# EAGLE board quantum_AnalougeEngine_V6_1 (EAGLE 9.6.2), part 1 of 2
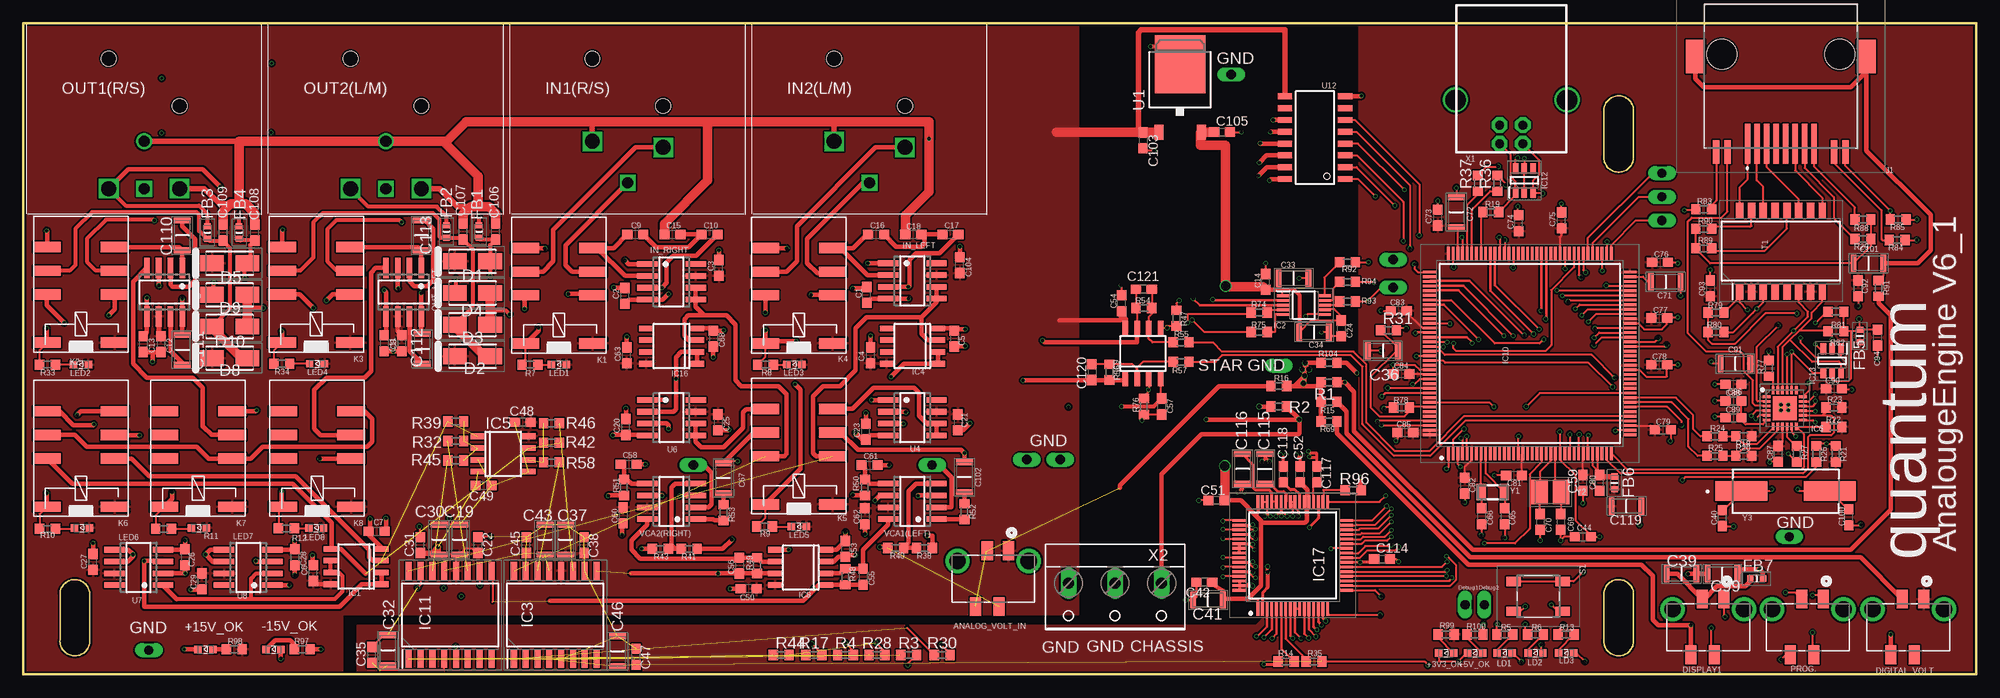
[diagram p12: board, top side]
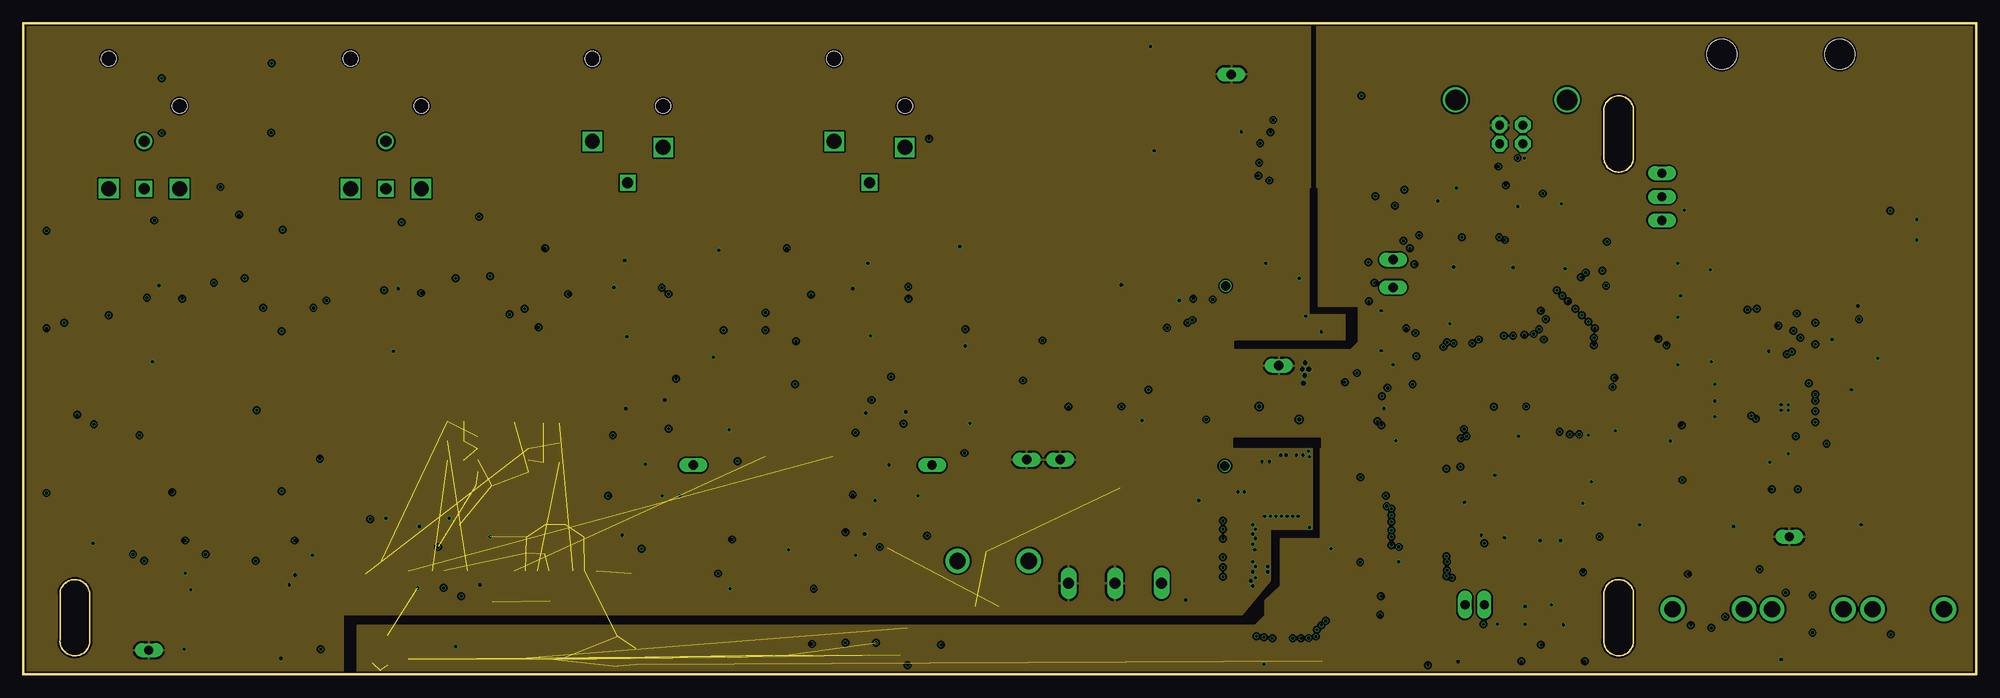
[diagram p13: board, inner layer midTop(AGND)]
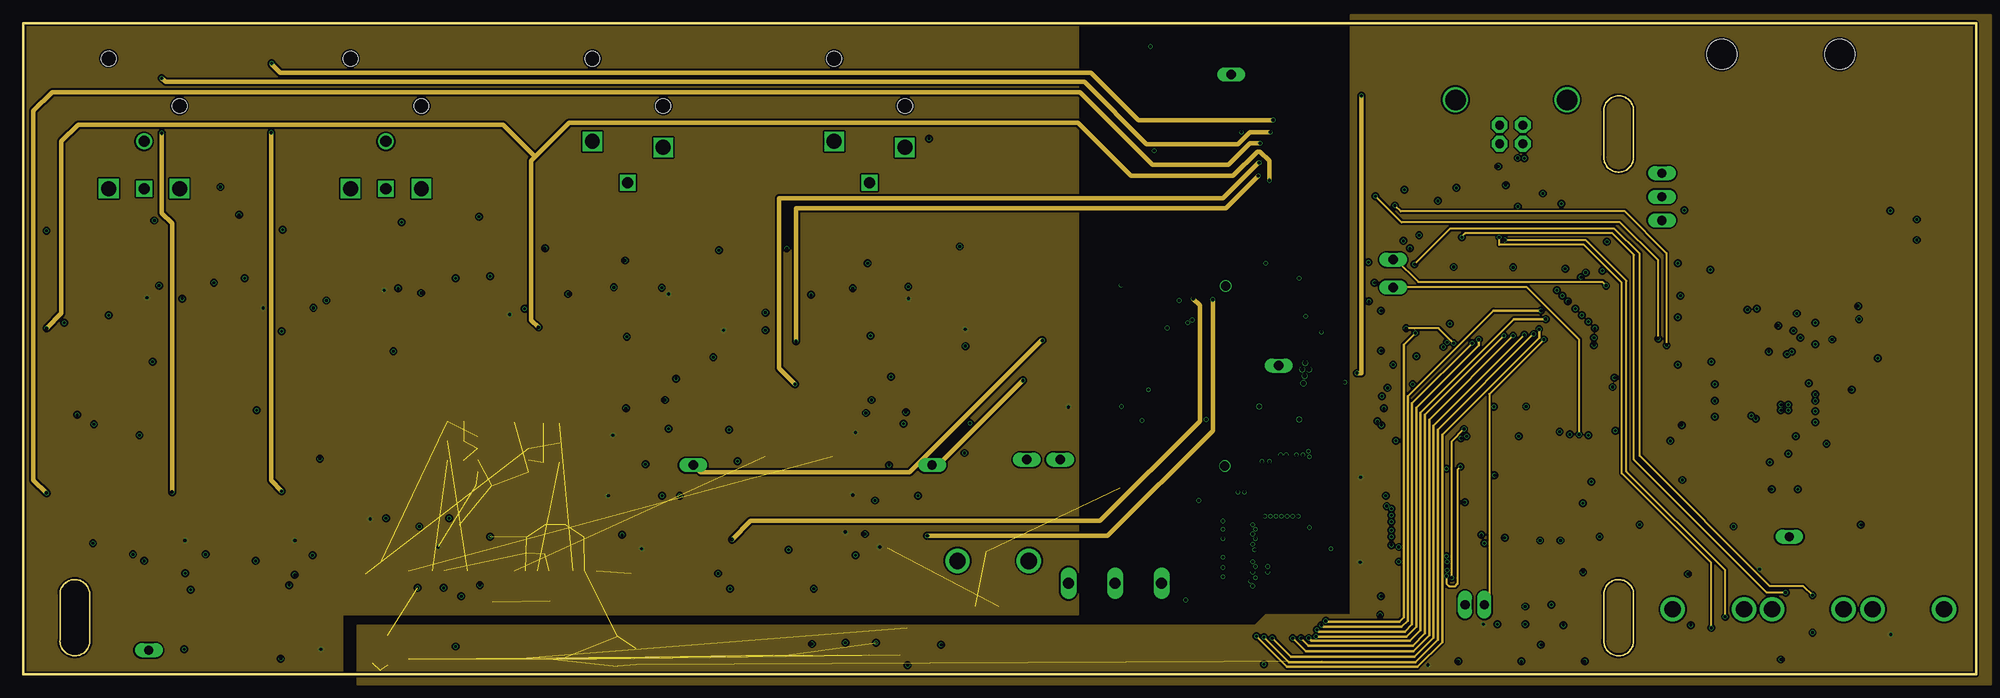
[diagram p14: board, inner layer midBottom(V-/+5V)]
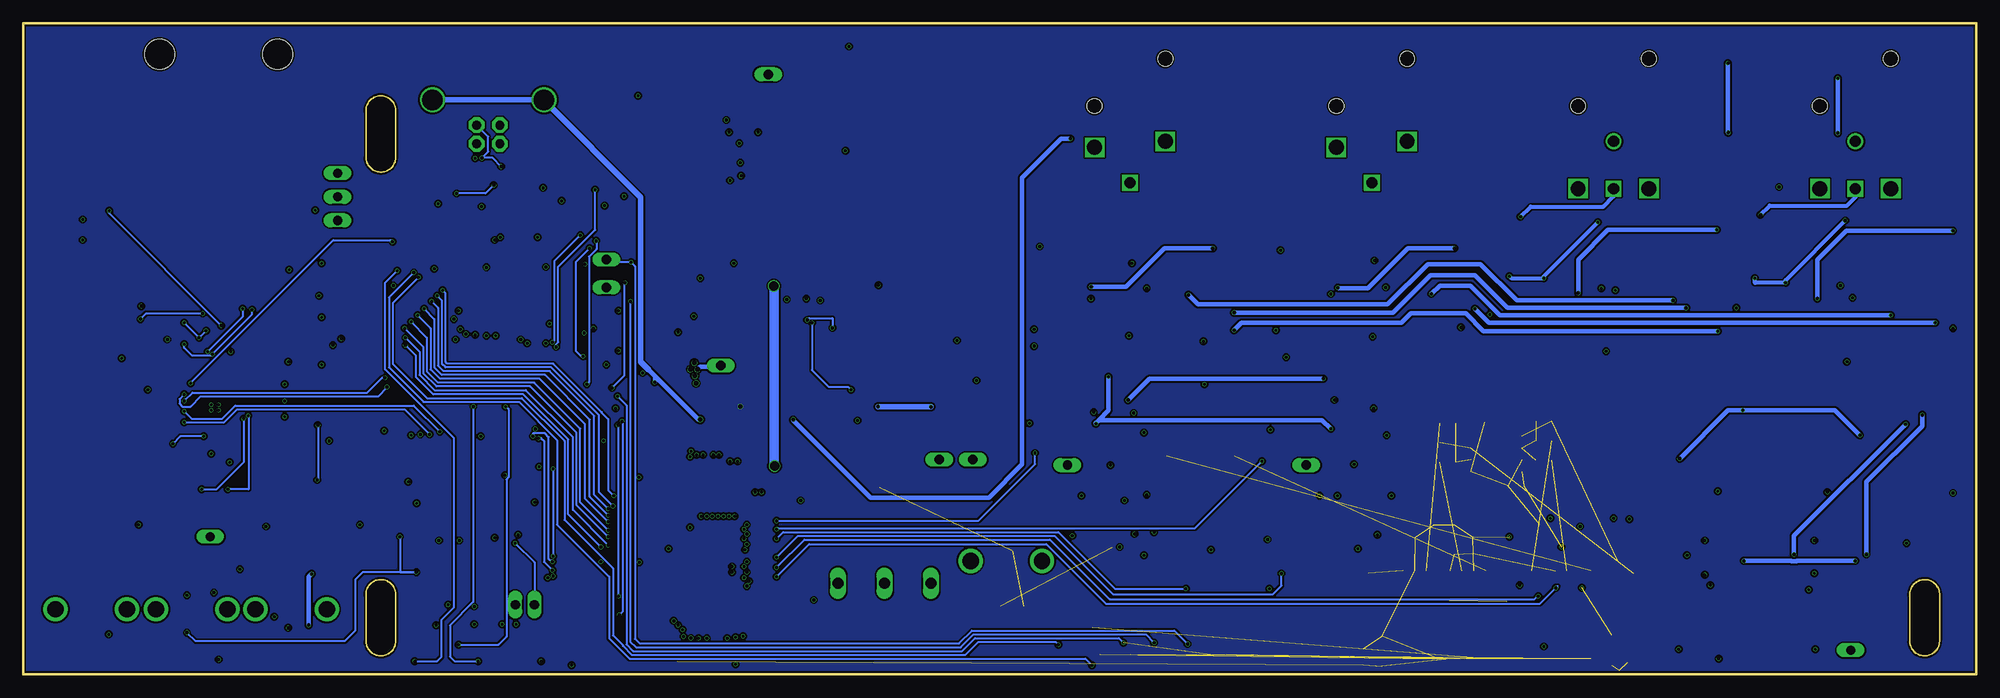
[diagram p15: board, bottom side, seen from below]

Size 210 x 70 mm. Coordinates in mm from the lower left corner, seen from the top.
Outline: 0,0 210,0 210,70 0,70 0,0
Outline: 169.95,60.7 arc-180 173.15,60.5 173.15,55.5 arc-180 169.95,55.7 169.95,60.7
Outline: 169.95,8.7 arc-180 173.15,8.5 173.15,3.5 arc-180 169.95,3.7 169.95,8.7
Outline: 3.95,8.7 arc-180 7.15,8.5 7.15,3.5 arc-180 3.95,3.7 3.95,8.7
Copper layers (1*2+15*16): Top(V+/+3V3) 0.018mm / dielectric 0.362mm / midTop(AGND) 0.035mm / dielectric 0.71mm / midBottom(V-/+5V) 0.035mm / dielectric 0.362mm / Bottom 0.018mm
Design rules "4layer": minimum track width 0.2mm, minimum drill 0.2mm, track to track 0.2mm, track to pad 0.1mm, pad to pad 0.1mm, via to via 0.1mm, smd to smd 0.1mm, copper to edge 0.2mm, drill to drill 0.21mm, minimum pad ring 0.25mm, minimum via ring 0.05mm, stop-mask expansion 0.01mm, vias tented up to drill 0mil, thermal gap 10mil

## Footprints (pad centres in the part's own frame; a part is rotated, then mirrored left to right if it is on the bottom)
WL-SMCW_0603 = smd 0.8 x 0.8: 1 -0.8,0; 2 0.8,0
MOLEX_90814-0204 = smd 1.194 x 2.007: 1 0.254,0; 2 1.27,5.994; 3 2.54,0; 4 3.81,5.994 | drill 1.753 pad 2.629: 5 -1.93,1.092; 6 5.74,1.092
C0603 = smd 1.1 x 1: 1 -0.85,0; 2 0.85,0
C1206 = smd 0.62 x 1.82: 1 -1.6,0; 2 1.6,0
DIONM5025X231N = smd 2.55 x 1.7: 1 -1.9,0; 2 1.9,0
THT_PIN = drill 1 long: P$1 0,0
BLM18KG102SH1J = smd 0.65 x 0.7: 1 -0.675,0; 2 0.675,0
SOIC8 = smd 0.6 x 1.5: 1 -1.905,-2.75; 2 -0.635,-2.75; 3 0.635,-2.75; 4 1.905,-2.75; 5 1.905,2.75; 6 0.635,2.75; 7 -0.635,2.75; 8 -1.905,2.75
SOP50P490X110-10N = smd 1.4 x 0.3: 1 -2.2,1; 2 -2.2,0.5; 3 -2.2,0; 4 -2.2,-0.5; 5 -2.2,-1; 6 2.2,-1; 7 2.2,-0.5; 8 2.2,0; 9 2.2,0.5; 10 2.2,1
SOIC127P1030X265-16N = smd 1.95 x 0.65: 1 -4.725,4.445; 2 -4.725,3.175; 3 -4.725,1.905; 4 -4.725,0.635; 5 -4.725,-0.635; 6 -4.725,-1.905; 7 -4.725,-3.175; 8 -4.725,-4.445; 9 4.725,-4.445; 10 4.725,-3.175; 11 4.725,-1.905; 12 4.725,-0.635; 13 4.725,0.635; 14 4.725,1.905; 15 4.725,3.175; 16 4.725,4.445
QFN50P400X400X100-25N = smd 0.85 x 0.3: 1 -1.95,1.25; 2 -1.95,0.75; 3 -1.95,0.25; 4 -1.95,-0.25; 5 -1.95,-0.75; 6 -1.95,-1.25; 13 1.95,-1.25; 14 1.95,-0.75; 15 1.95,-0.25; 16 1.95,0.25; 17 1.95,0.75; 18 1.95,1.25 | smd 0.3 x 0.85: 7 -1.25,-1.95; 8 -0.75,-1.95; 9 -0.25,-1.95; 10 0.25,-1.95; 11 0.75,-1.95; 12 1.25,-1.95; 19 1.25,1.95; 20 0.75,1.95; 21 0.25,1.95; 22 -0.25,1.95; 23 -0.75,1.95; 24 -1.25,1.95 | smd 2.6 x 2.6: 25 0,0
QFP50P2200X2200X160-144N = smd 1.475 x 0.3: 1 -10.738,8.75; 2 -10.738,8.25; 3 -10.738,7.75; 4 -10.738,7.25; 5 -10.738,6.75; 6 -10.738,6.25; 7 -10.738,5.75; 8 -10.738,5.25; 9 -10.738,4.75; 10 -10.738,4.25; 11 -10.738,3.75; 12 -10.738,3.25; 13 -10.738,2.75; 14 -10.738,2.25; 15 -10.738,1.75; 16 -10.738,1.25; 17 -10.738,0.75; 18 -10.738,0.25; 19 -10.738,-0.25; 20 -10.738,-0.75; 21 -10.738,-1.25; 22 -10.738,-1.75; 23 -10.738,-2.25; 24 -10.738,-2.75; 25 -10.738,-3.25; 26 -10.738,-3.75; 27 -10.738,-4.25; 28 -10.738,-4.75; 29 -10.738,-5.25; 30 -10.738,-5.75; 31 -10.738,-6.25; 32 -10.738,-6.75; 33 -10.738,-7.25; 34 -10.738,-7.75; 35 -10.738,-8.25; 36 -10.738,-8.75; 73 10.738,-8.75; 74 10.738,-8.25; 75 10.738,-7.75; 76 10.738,-7.25; 77 10.738,-6.75; 78 10.738,-6.25; 79 10.738,-5.75; 80 10.738,-5.25; 81 10.738,-4.75; 82 10.738,-4.25; 83 10.738,-3.75; 84 10.738,-3.25; 85 10.738,-2.75; 86 10.738,-2.25; 87 10.738,-1.75; 88 10.738,-1.25; 89 10.738,-0.75; 90 10.738,-0.25; 91 10.738,0.25; 92 10.738,0.75; 93 10.738,1.25; 94 10.738,1.75; 95 10.738,2.25; 96 10.738,2.75; 97 10.738,3.25; 98 10.738,3.75; 99 10.738,4.25; 100 10.738,4.75; 101 10.738,5.25; 102 10.738,5.75; 103 10.738,6.25; 104 10.738,6.75; 105 10.738,7.25; 106 10.738,7.75; 107 10.738,8.25; 108 10.738,8.75 | smd 0.3 x 1.475: 37 -8.75,-10.738; 38 -8.25,-10.738; 39 -7.75,-10.738; 40 -7.25,-10.738; 41 -6.75,-10.738; 42 -6.25,-10.738; 43 -5.75,-10.738; 44 -5.25,-10.738; 45 -4.75,-10.738; 46 -4.25,-10.738; 47 -3.75,-10.738; 48 -3.25,-10.738; 49 -2.75,-10.738; 50 -2.25,-10.738; 51 -1.75,-10.738; 52 -1.25,-10.738; 53 -0.75,-10.738; 54 -0.25,-10.738; 55 0.25,-10.738; 56 0.75,-10.738; 57 1.25,-10.738; 58 1.75,-10.738; 59 2.25,-10.738; 60 2.75,-10.738; 61 3.25,-10.738; 62 3.75,-10.738; 63 4.25,-10.738; 64 4.75,-10.738; 65 5.25,-10.738; 66 5.75,-10.738; 67 6.25,-10.738; 68 6.75,-10.738; 69 7.25,-10.738; 70 7.75,-10.738; 71 8.25,-10.738; 72 8.75,-10.738; 109 8.75,10.738; 110 8.25,10.738; 111 7.75,10.738; 112 7.25,10.738; 113 6.75,10.738; 114 6.25,10.738; 115 5.75,10.738; 116 5.25,10.738; 117 4.75,10.738; 118 4.25,10.738; 119 3.75,10.738; 120 3.25,10.738; 121 2.75,10.738; 122 2.25,10.738; 123 1.75,10.738; 124 1.25,10.738; 125 0.75,10.738; 126 0.25,10.738; 127 -0.25,10.738; 128 -0.75,10.738; 129 -1.25,10.738; 130 -1.75,10.738; 131 -2.25,10.738; 132 -2.75,10.738; 133 -3.25,10.738; 134 -3.75,10.738; 135 -4.25,10.738; 136 -4.75,10.738; 137 -5.25,10.738; 138 -5.75,10.738; 139 -6.25,10.738; 140 -6.75,10.738; 141 -7.25,10.738; 142 -7.75,10.738; 143 -8.25,10.738; 144 -8.75,10.738
SOT95P280X145-6N = smd 1.15 x 0.6: 1 -1.3,0.95; 2 -1.3,0; 3 -1.3,-0.95; 4 1.3,-0.95; 5 1.3,0; 6 1.3,0.95
QFP50P1200X1200X160-64N = smd 1.475 x 0.3: 1 -5.738,3.75; 2 -5.738,3.25; 3 -5.738,2.75; 4 -5.738,2.25; 5 -5.738,1.75; 6 -5.738,1.25; 7 -5.738,0.75; 8 -5.738,0.25; 9 -5.738,-0.25; 10 -5.738,-0.75; 11 -5.738,-1.25; 12 -5.738,-1.75; 13 -5.738,-2.25; 14 -5.738,-2.75; 15 -5.738,-3.25; 16 -5.738,-3.75; 33 5.738,-3.75; 34 5.738,-3.25; 35 5.738,-2.75; 36 5.738,-2.25; 37 5.738,-1.75; 38 5.738,-1.25; 39 5.738,-0.75; 40 5.738,-0.25; 41 5.738,0.25; 42 5.738,0.75; 43 5.738,1.25; 44 5.738,1.75; 45 5.738,2.25; 46 5.738,2.75; 47 5.738,3.25; 48 5.738,3.75 | smd 0.3 x 1.475: 17 -3.75,-5.738; 18 -3.25,-5.738; 19 -2.75,-5.738; 20 -2.25,-5.738; 21 -1.75,-5.738; 22 -1.25,-5.738; 23 -0.75,-5.738; 24 -0.25,-5.738; 25 0.25,-5.738; 26 0.75,-5.738; 27 1.25,-5.738; 28 1.75,-5.738; 29 2.25,-5.738; 30 2.75,-5.738; 31 3.25,-5.738; 32 3.75,-5.738; 49 3.75,5.738; 50 3.25,5.738; 51 2.75,5.738; 52 2.25,5.738; 53 1.75,5.738; 54 1.25,5.738; 55 0.75,5.738; 56 0.25,5.738; 57 -0.25,5.738; 58 -0.75,5.738; 59 -1.25,5.738; 60 -1.75,5.738; 61 -2.25,5.738; 62 -2.75,5.738; 63 -3.25,5.738; 64 -3.75,5.738
NEUTRIK_NC3FAH = drill 1.6 square: 1 -3.81,-12.7; 2 3.81,-13.335 | drill 1.2 square: 3 0,-17.15 | hole 1.6: -3.81,-3.81; 3.81,-8.89
SO08 = smd 0.6 x 2.2: 1 -1.905,-2.6; 2 -0.635,-2.6; 3 0.635,-2.6; 4 1.905,-2.6; 5 1.905,2.6; 6 0.635,2.6; 7 -0.635,2.6; 8 -1.905,2.6
GWLEXSMTS988GY = smd 0.61 x 4.3: 1 3.57,7.05; 2 2.55,7.05; 3 1.53,7.05; 4 0.51,7.05; 5 -0.51,7.05; 6 -1.53,7.05; 7 -2.55,7.05; 8 -3.57,7.05 | smd 0.7 x 2.5: 9 6.95,7.95; 10 5.74,7.95; 11 -5.74,7.95; 12 -6.95,7.95 | smd 2.032 x 3.6: MP1 -9.204,-2.3; MP2 9.204,-2.3 | hole 3.25: -6.35,-2.55; 6.35,-2.55
351 = smd 1.11 x 3: 1 -2.623,-3.645; 2 -2.623,3.645; P1 5.096,-3.645; P2 5.096,3.645; Q1 2.556,-3.645; Q2 2.556,3.645; S1 7.636,-3.645; S2 7.636,3.645
NEUTRIK_NC3MAH = drill 1.6 square: 1 3.81,-17.78; 2 -3.81,-17.78 | drill 1.2 square: 3 0,-17.78 | drill 1.2: G 0,-12.7 | hole 1.6: -3.81,-3.8; 3.81,-8.89
R0603 = smd 1 x 1.1: 1 -0.85,0; 2 0.85,0
PTS647SN50SMTR2LFS = smd 1.55 x 1: 1 -2.625,-1.6; 2 2.625,-1.6; 3 2.625,1.6; 4 -2.625,1.6
SOIC127P940X597-16N = smd 1.645 x 0.8: 1 -4.378,4.445; 2 -4.378,3.175; 3 -4.378,1.905; 4 -4.378,0.635; 5 -4.378,-0.635; 6 -4.378,-1.905; 7 -4.378,-3.175; 8 -4.378,-4.445; 9 4.378,-4.445; 10 4.378,-3.175; 11 4.378,-1.905; 12 4.378,-0.635; 13 4.378,0.635; 14 4.378,1.905; 15 4.378,3.175; 16 4.378,4.445
TO252 = smd 1 x 1.6: 1 -2.28,-4.8; 3 2.28,-4.8 | smd 5.4 x 6.2: 2 0,2.5
SOIC16 = smd 1.524 x 0.635: 1 -3.24,4.445; 2 -3.24,3.175; 3 -3.24,1.905; 4 -3.24,0.635; 5 -3.24,-0.635; 6 -3.24,-1.905; 7 -3.24,-3.175; 8 -3.24,-4.445; 9 3.24,-4.445; 10 3.24,-3.175; 11 3.24,-1.905; 12 3.24,-0.635; 13 3.24,0.635; 14 3.24,1.905; 15 3.24,3.175; 16 3.24,4.445
SMARTPRJ_PN61729 = drill 0.95 pad 1.676 octagon: 1 1.25,4.71; 2 -1.25,4.71; 3 -1.25,2.71; 4 1.25,2.71 | drill 2.2: P$1 -6,0; P$2 6,0
W237-103 = drill 1.194 long: 1 -5,-1.29; 2 0,-1.29; 3 5,-1.29
NX3215SA = smd 1 x 1.8: 1 -1.25,0; 2 1.25,0
RESC3226X100N = smd 1.75 x 2.65: 1 -1.15,0; 2 1.15,0
ABLS = smd 5.6 x 2.1: 1 -4.75,0; 2 4.75,0

## Placement (x,y rotation side)
+3V3_OK  LED_GREEN_SMD  [WL-SMCW_0603]  153,2.3 0 top
+5V_OK  LED_GREEN_SMD  [WL-SMCW_0603]  156.1,2.3 0 top
+15V_OK  LED_GREEN_SMD  [WL-SMCW_0603]  19.6,2.7 0 top
-15V_OK  LED_GREEN_SMD  [WL-SMCW_0603]  26.9,2.7 0 top
ANALOG_VOLT_IN  90814-0204  [MOLEX_90814-0204]  106.2,13.3 180 top
C1  100 nF  [C0603]  90.7,40.8 90 top
C2  100 nF  [C0603]  64.7,40.7 90 top
C3  100 nF  [C0603]  74.8,43.7 90 top
C4  100 nF  [C0603]  91.1,34.3 90 top
C5  100 nF  [C0603]  100.1,36.1 270 top
C6  100 nF  [C0603]  31.2,10.9 90 top
C7  100 nF  [C0603]  38,15.4 0 top
C8  100 nF  [C0603]  40.7,35.6 270 top
C9  470 pF  [C0603]  65.8,47.3 0 top
C10  470 pF  [C0603]  73.8,47.3 0 top
C11  100 nF  [C0603]  38.8,35.6 270 top
C12  100 nF  [C0603]  14.8,35.5 270 top
C13  100 nF  [C0603]  12.9,35.5 270 top
C14  100 nF  [C0603]  133.6,42.2 90 top
C15  47 pF  [C0603]  69.8,47.3 0 top
C16  470 pF  [C0603]  91.7,47.3 0 top
C17  470 pF  [C0603]  99.7,47.3 0 top
C18  47 pF  [C0603]  95.7,47.3 0 top
C19  10 uF  [C1206]  46.9,14.5 90 top
C20  100 nF  [C0603]  64.8,26.6 90 top
C21  100 nF  [C0603]  100.5,27.1 270 top
C22  100 nF  [C0603]  48.9,13.9 90 top
C23  100 nF  [C0603]  90.6,26.1 90 top
C24  100 nF  [C0603]  141.7,37.2 270 top
C25  100 nF  [C0603]  74.7,27.1 270 top
C26  100 nF  [C0603]  17.4,12.6 270 top
C27  100 nF  [C0603]  7.5,12.1 90 top
C28  100 nF  [C0603]  29.2,12.6 270 top
C29  100 nF  [C0603]  19.2,10 270 top
C30  10 uF  [C1206]  44.7,14.5 90 top
C31  100 nF  [C0603]  42.7,13.9 90 top
C32  10 uF  [C1206]  39.2,2.6 90 top
C33  10 uF  [C1206]  136.6,42.6 0 top
C34  10 uF  [C1206]  138.8,36.8 0 top
C35  100 nF  [C0603]  37.5,2.1 90 top
C36  2.2 uF  [C1206]  146.2,34.8 0 top
C37  10 uF  [C1206]  58.3,14.5 90 top
C38  100 nF  [C0603]  60.3,13.9 90 top
C39  10 uF  [C1206]  178.3,10.8 0 top
C40  30 pF  [C0603]  182.7,16.8 90 top
C41  10 uF  [C1206]  127.4,8 180 top
C42  100 nF  [C0603]  127,9.9 180 top
C43  10 uF  [C1206]  56.1,14.5 90 top
C44  100 nF  [C0603]  167.7,14.8 0 top
C45  100 nF  [C0603]  54.1,13.9 90 top
C46  10 uF  [C1206]  63.9,2.5 90 top
C47  100 nF  [C0603]  65.9,1.9 90 top
C48  100 nF  [C0603]  53.7,27.1 180 top
C49  100 nF  [C0603]  49.5,20.3 0 top
C50  100 nF  [C0603]  78,9.2 180 top
C51  100 nF  [C0603]  128.3,18.7 180 top
C52  100 nF  [C0603]  137.3,21.5 90 top
C53  100 nF  [C0603]  88.4,13.5 270 top
C54  100 nF  [C0603]  118.1,39.9 90 top
C55  22 pF  [C0603]  90.3,10.5 270 top
C56  22 pF  [C0603]  77,11.7 270 top
C57  100 nF  [C0603]  122.4,28.8 270 top
C58  100 nF  [C0603]  65.1,22.6 0 top
C59  100 nF  [C0603]  167.7,20.6 90 top
C60  100 nF  [C0603]  64.5,17.1 270 top
C61  100 nF  [C0603]  91,22.5 0 top
C62  100 nF  [C0603]  90.5,17 270 top
C63  100 nF  [C0603]  64.9,34.3 90 top
C65  2.7 pF  [C0603]  159.3,17 270 top
C66  2.7 pF  [C0603]  156.8,17 270 top
C67  10 uF  [C1206]  75.3,21.1 270 top
C68  100 nF  [C0603]  74.2,36.1 270 top
C69  4.3 pF  [C0603]  165.3,16.4 270 top
C70  4.3 pF  [C0603]  163.1,16.4 270 top
C71  2.2 uF  [C1206]  176.6,42.2 0 top
C72  2.2 uF  [C1206]  154.1,49.7 90 top
C73  100 nF  [C0603]  152.1,49.1 90 top
C74  100 nF  [C0603]  160.8,48.5 90 top
C75  100 nF  [C0603]  165.4,48.8 90 top
C76  100 nF  [C0603]  176,44.3 0 top
C77  100 nF  [C0603]  175.9,38.3 0 top
C78  100 nF  [C0603]  175.9,33.3 0 top
C79  100 nF  [C0603]  176.3,26.3 0 top
C80  100 nF  [C0603]  169.5,20.6 90 top
C81  100 nF  [C0603]  160.3,21.4 0 top
C82  100 nF  [C0603]  155,20.3 90 top
C83  100 nF  [C0603]  147.9,39.1 180 top
C84  100 nF  [C0603]  148.2,32.3 180 top
C85  100 nF  [C0603]  148.6,26 180 top
C86  100 nF  [C0603]  183.9,31.2 0 top
C87  100 nF  [C0603]  188.7,23.7 90 top
C88  1 uF  [C0603]  183.9,29.4 0 top
C89  470 pF  [C0603]  183.9,27.6 0 top
C90  100 nF  [C0603]  194.7,30.7 180 top
C91  10 uF  [C1206]  184.1,33.4 180 top
C92  100 nF  [C0603]  197.3,41.5 90 top
C93  100 nF  [C0603]  181.4,41.5 270 top
C94  100 nF  [C0603]  199.4,36.2 90 top
C99  10 uF  [C1206]  182.7,10.8 180 top
C100  30 pF  [C0603]  196.3,16.9 90 top
C101  4.7 uF  [C1206]  198.4,44.2 0 top
C102  10 uF  [C1206]  101.2,21.2 270 top
C103  330 nF  [C0603]  120.4,57.4 270 top
C104  100 nF  [C0603]  100.7,44 90 top
C105  100 nF  [C0603]  128.9,58.3 0 top
C106  100 nF  [C0603]  50.8,47.6 90 top
C107  100 nF  [C0603]  47.3,47.6 90 top
C108  100 nF  [C0603]  24.9,47.5 90 top
C109  100 nF  [C0603]  21.5,47.5 90 top
C110  10 uF  [C1206]  17.1,47.2 270 top
C111  10 uF  [C1206]  17.1,34.9 90 top
C112  10 uF  [C1206]  42.9,35 90 top
C113  10 uF  [C1206]  42.8,47.2 270 top
C114  100 nF  [C0603]  146.1,12.4 0 top
C115  10 uF  [C1206]  133.5,22.1 90 top
C116  10 uF  [C1206]  131.1,22.1 270 top
C117  1 uF  [C0603]  139.1,21.5 90 top
C118  1 uF  [C0603]  135.5,21.5 90 top
C119  4.7 uF  [C1206]  172.4,18.1 180 top
C120  22 pF  [C0603]  114.9,32.5 270 top
C121  22 pF  [C0603]  120.5,41.4 180 top
D1  FM4004-W  [DIONM5025X231N]  48.3,44.4 0 top
D2  FM4004-W  [DIONM5025X231N]  48.3,34.2 0 top
D3  FM4004-W  [DIONM5025X231N]  48.3,37.6 0 top
D4  FM4004-W  [DIONM5025X231N]  48.3,41 0 top
D5  FM4004-W  [DIONM5025X231N]  22.2,44.2 0 top
D8  FM4004-W  [DIONM5025X231N]  22.2,34 0 top
D9  FM4004-W  [DIONM5025X231N]  22.2,40.8 0 top
D10  FM4004-W  [DIONM5025X231N]  22.2,37.4 0 top
DEBUG1  TPTHT  [THT_PIN]  155.04,7.5 90 top
DEBUG2  TPTHT  [THT_PIN]  157.1,7.5 90 top
DIGITAL_VOLT  90814-0204  [MOLEX_90814-0204]  204.6,8.1 180 top
DISPLAY1  90814-0204  [MOLEX_90814-0204]  183.1,8.1 180 top
FB1  FERITTE-BREAD  [BLM18KG102SH1J]  49,47.6 90 top
FB2  FERITTE-BREAD  [BLM18KG102SH1J]  45.5,47.6 90 top
FB3  FERITTE-BREAD  [BLM18KG102SH1J]  19.8,47.5 90 top
FB4  FERITTE-BREAD  [BLM18KG102SH1J]  23.2,47.5 90 top
FB5  0 R  [BLM18KG102SH1J]  197.5,36.4 90 top
FB6  FERITTE-BREAD  [BLM18KG102SH1J]  171.1,20.6 90 top
FB7  FERITTE-BREAD  [BLM18KG102SH1J]  186.4,10.3 0 top
GND  TPTHT  [THT_PIN]  189.9,14.8 0 top
IC1  OP275  [SOIC8]  35.8,11.6 90 top
IC2  DAC084S085CIMM_NOPB  [SOP50P490X110-10N]  137.7,39.7 0 top
IC3  PGA2320IDW  [SOIC127P1030X265-16N]  57.2,6.4 90 top
IC4  OP275  [SOIC8]  95.6,35.3 90 top
IC5  OP275  [SOIC8]  51.6,23.7 270 top
IC6  LAN8742A-CZ-TR  [QFN50P400X400X100-25N]  189.4,28.6 0 top
IC8  OP275  [SOIC8]  83.6,11.5 90 top
IC9  NE5532  [SOIC8]  120.4,34.5 0 top
IC10  STM32F767ZIT6  [QFP50P2200X2200X160-144N]  162,34.5 90 top
IC11  PGA2320IDW  [SOIC127P1030X265-16N]  45.9,6.4 90 top
IC12  ESDA6V1BC6  [SOT95P280X145-6N]  161.4,53.1 90 top
IC13  USBLC6-4SC6  [SOT95P280X145-6N]  194.5,33.7 270 top
IC16  OP275  [SOIC8]  69.7,35.3 90 top
IC17  AD7606BSTZ-6  [QFP50P1200X1200X160-64N]  136.5,12.8 90 top
IN1(R/S)  NEUTRIK_NC3FAH  [NEUTRIK_NC3FAH]  65,70 0 top
IN2(L/M)  NEUTRIK_NC3FAH  [NEUTRIK_NC3FAH]  91,70 0 top
IN_LEFT  THAT1240  [SO08]  95.6,42.3 270 top
IN_RIGHT  THAT1240  [SO08]  69.7,42.2 270 top
J1  GWLEX-SMT-S988G_Y  [GWLEXSMTS988GY]  188.99,64.11 180 top
K1  Relay  [351]  57.6,38.2 90 top
K2  Relay  [351]  6.2,38.3 90 top
K3  Relay  [351]  31.5,38.3 90 top
K4  Relay  [351]  83.4,38.2 90 top
K5  Relay  [351]  83.4,20.9 90 top
K6  Relay  [351]  6.2,20.65 90 top
K7  Relay  [351]  18.8,20.65 90 top
K8  Relay  [351]  31.6,20.65 90 top
LD1  LED_YELOW_SMD  [WL-SMCW_0603]  159.3,2.3 0 top
LD2  LED_RED_SMD  [WL-SMCW_0603]  162.6,2.3 0 top
LD3  LED_GREEN_SMD  [WL-SMCW_0603]  165.9,2.3 0 top
LED1  LED_BLUE_SMD  [WL-SMCW_0603]  57.6,33.3 0 top
LED2  LED_BLUE_SMD  [WL-SMCW_0603]  6.2,33.3 0 top
LED3  LED_BLUE_SMD  [WL-SMCW_0603]  82.9,33.3 0 top
LED4  LED_BLUE_SMD  [WL-SMCW_0603]  31.6,33.4 0 top
LED5  LED_BLUE_SMD  [WL-SMCW_0603]  83.4,15.9 0 top
LED6  LED_BLUE_SMD  [WL-SMCW_0603]  6.3,15.75 0 top
LED7  LED_BLUE_SMD  [WL-SMCW_0603]  18.9,15.75 0 top
LED8  LED_BLUE_SMD  [WL-SMCW_0603]  31.5,15.75 0 top
OUT1(R/S)  NEUTRIK_NC3MAH  [NEUTRIK_NC3MAH]  13,70 0 top
OUT2(L/M)  NEUTRIK_NC3MAH  [NEUTRIK_NC3MAH]  39,70 0 top
OUT_LEFT  THAT1646  [SO08]  40.9,41.1 180 top
OUT_RIGHT  THAT1646  [SO08]  15.2,41.1 180 top
PROG.  90814-0204  [MOLEX_90814-0204]  193.8,8.1 180 top
R1  0 R  [R0603]  140.4,31.4 180 top
R2  0 R  [R0603]  135,28.8 180 top
R3  500 R  [R0603]  95.2,2.1 0 top
R4  500 R  [R0603]  88.4,2.1 0 top
R5  680 R  [R0603]  159.3,4.3 0 top
R6  680 R  [R0603]  162.6,4.3 0 top
R7  680 R  [R0603]  54.5,33.3 0 top
R8  680 R  [R0603]  79.8,33.3 0 top
R9  680 R  [R0603]  79.7,15.9 0 top
R10  680 R  [R0603]  2.6,15.65 0 top
R11  680 R  [R0603]  15.1,15.65 0 top
R12  680 R  [R0603]  28.3,15.7 0 top
R13  680 R  [R0603]  165.9,4.3 0 top
R14  10 k  [R0603]  135.8,1.4 180 top
R15  0 R  [R0603]  140.4,29.3 180 top
R16  0 R  [R0603]  135,31 0 top
R17  500 R  [R0603]  85,2.1 0 top
R18  10 k  [R0603]  185,25.6 180 top
R19  10 k  [R0603]  157.8,49.7 0 top
R20  10 k  [R0603]  185,23.5 180 top
R21  10 k  [R0603]  194.9,23.7 90 top
R22  1k5  [R0603]  194.7,26.6 180 top
R23  10 k  [R0603]  194.7,28.7 0 top
R24  33 R  [R0603]  181.9,25.6 0 top
R25  33 R  [R0603]  181.9,23.5 0 top
R26  33 R  [R0603]  192.8,23.7 90 top
R27  10 k  [R0603]  190.7,23.7 90 top
R28  500 R  [R0603]  91.8,2.1 0 top
R29  75 R  [R0603]  197.8,46.8 180 top
R30  500 R  [R0603]  98.8,2.1 0 top
R31  0 R  [R0603]  146.8,37 0 top
R32  10 k  [R0603]  46.5,25.1 0 top
R33  680 R  [R0603]  2.6,33.3 0 top
R34  680 R  [R0603]  27.8,33.4 0 top
R35  10 k  [R0603]  138.8,1.4 0 top
R36  0 R  [R0603]  158.5,52.8 90 top
R37  0 R  [R0603]  156.4,52.8 90 top
R38  27 k  [R0603]  96.9,13.6 0 top
R39  10 k  [R0603]  46.5,27.2 180 top
R40  160 k  [R0603]  93.8,13.6 0 top
R41  27 k  [R0603]  71.6,13.5 0 top
R42  10 k  [R0603]  56.8,24.9 0 top
R43  160 k  [R0603]  68.5,13.5 0 top
R44  500 R  [R0603]  81.5,2.1 0 top
R45  10 k  [R0603]  46.5,23 0 top
R46  10 k  [R0603]  56.8,27 180 top
R47  1k8  [R0603]  124,38.3 270 top
R48  20 k  [R0603]  88.4,10.5 270 top
R49  20 k  [R0603]  78.9,11.7 270 top
R50  5k1  [R0603]  90.5,20.1 90 top
R51  5k1  [R0603]  64.6,20.1 90 top
R52  20 k  [R0603]  101.2,17.5 270 top
R53  20 k  [R0603]  75.3,17.4 270 top
R54  10 k  [R0603]  120.5,39.4 180 top
R55  10 k  [R0603]  124.5,35.7 180 top
R56  10 k  [R0603]  116.8,32.5 270 top
R57  10 k  [R0603]  124.5,33.6 180 top
R58  10 k  [R0603]  56.8,22.8 180 top
R69  0 R  [R0603]  140.4,27.2 180 top
R74  10 k  [R0603]  132.9,38.9 180 top
R75  10 k  [R0603]  132.9,36.8 180 top
R76  1k8  [R0603]  120.5,28.8 90 top
R77  12k1  [R0603]  187.7,32.9 90 top
R78  10 k  [R0603]  148.2,28.7 180 top
R79  50 R  [R0603]  182,38.9 180 top
R80  50 R  [R0603]  182,36.8 180 top
R81  50 R  [R0603]  194.9,39 0 top
R82  50 R  [R0603]  194.9,36.9 0 top
R83  270 R  [R0603]  180.7,50 0 top
R84  270 R  [R0603]  201.5,46.7 180 top
R85  10 k  [R0603]  201.6,48.9 180 top
R88  75 R  [R0603]  197.8,48.9 180 top
R89  75 R  [R0603]  180.7,45.8 0 top
R90  75 R  [R0603]  180.7,47.9 0 top
R91  0 R  [R0603]  199.5,41.5 90 top
R92  500 R  [R0603]  142.4,44.3 0 top
R93  500 R  [R0603]  142.4,40.1 0 top
R94  500 R  [R0603]  142.4,42.2 0 top
R96  10 k  [R0603]  143,19.8 180 top
R97  680 R  [R0603]  30,2.7 180 top
R98  680 R  [R0603]  22.7,2.7 0 top
R99  65 R  [R0603]  153,4.3 0 top
R100  150 R  [R0603]  156.1,4.3 0 top
R104  0 R  [R0603]  140.4,33.5 180 top
S1  PTS647SN50SMTR2LFS  [PTS647SN50SMTR2LFS]  162.9,8.4 0 top
STARGROUND  TPTHT  [THT_PIN]  135,33.2 0 top
T1  H1102NL  [SOIC127P940X597-16N]  189,45.5 90 top
TP01  TPTHT  [THT_PIN]  13.5,2.6 0 top
TP02  TPTHT  [THT_PIN]  107.9,23.1 0 top
TP03  TPTHT  [THT_PIN]  147.3,44.6 0 top
TP04  TPTHT  [THT_PIN]  147.3,41.6 0 top
TP05  TPTHT  [THT_PIN]  176.2,48.8 0 top
TP06  TPTHT  [THT_PIN]  176.2,51.34 0 top
TP07  TPTHT  [THT_PIN]  176.2,53.88 0 top
TP08  TPTHT  [THT_PIN]  111.5,23.1 0 top
TP09  TPTHT  [THT_PIN]  129.9,64.5 0 top
TP36  TPTHT  [THT_PIN]  72.04,22.5 180 top
TP37  TPTHT  [THT_PIN]  97.72,22.5 180 top
U1  78*_SMD  [TO252]  124.4,63.1 0 top
U4  THAT1240  [SO08]  95.6,27.6 270 top
U6  THAT1240  [SO08]  69.7,27.6 270 top
U7  THAT1240  [SO08]  12.4,11.5 90 top
U8  THAT1240  [SO08]  24.2,11.5 90 top
U12  ULN2003  [SOIC16]  138.9,57.7 180 top
VCA1(LEFT)  THAT2181SO8-US  [SO08]  95.6,18.6 90 top
VCA2(RIGHT)  THAT2181SO8-US  [SO08]  69.7,18.6 90 top
X1  [SMARTPRJ_PN61729]  160,61.76 180 top
X2  [W237-103]  117.4,8.5 180 top
Y1  NX3215SA-32.768K-STD-MUA-8  [NX3215SA]  158,19.6 0 top
Y2  NX3225GD-8MHZ-STD-CRA-3  [RESC3226X100N]  164.2,19.6 0 top
Y3  ABLS2-25.000MHZ-D4YF-T  [ABLS]  189.5,19.7 0 top